# Altium project EL.T01.MBRD.PrjPcb (part 1 of 2)
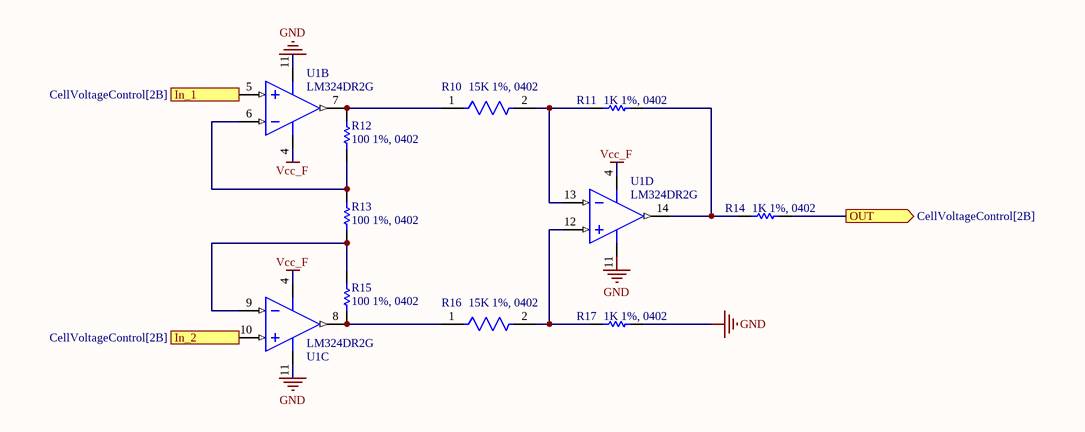
[diagram p0: DiffAmp_K-0.2.SchDoc]
7 sheets, 235 parts. Net scope: hierarchical (ports join the sheet entries above them; power ports are global).
Sheets:
  DiffAmp_K-0.2.SchDoc
  DiffAmp_K-10.SchDoc
  MainBoard.SchDoc
    CurrentSence = MainShunt.SchDoc
    Voltmetr = WideRangeVoltmeter.SchDoc
    CellVoltage = CellVoltageControl.SchDoc
      Voltmetr = WideRangeVoltmeter.SchDoc
      CellSelectModule = CellSelectModule.SchDoc
      CellSelectModule = CellSelectModule.SchDoc
      CellSelectModule = CellSelectModule.SchDoc
      CellSelectModule = CellSelectModule.SchDoc
      CellSelectModule = CellSelectModule.SchDoc
      CellSelectModule = CellSelectModule.SchDoc
      CellSelectModule = CellSelectModule.SchDoc
      CellSelectModule = CellSelectModule.SchDoc
      CellSelectModule = CellSelectModule.SchDoc
      CellSelectModule = CellSelectModule.SchDoc
      CellSelectModule = CellSelectModule.SchDoc
      CellSelectModule = CellSelectModule.SchDoc
      CellSelectModule = CellSelectModule.SchDoc
      CellSelectModule = CellSelectModule.SchDoc
      CellSelectModule = CellSelectModule.SchDoc
      CellSelectModule = CellSelectModule.SchDoc
      CellSelectModule = CellSelectModule.SchDoc
      CellSelectModule = CellSelectModule.SchDoc
      CellSelectModule = CellSelectModule.SchDoc
      CellSelectModule = CellSelectModule.SchDoc
      CellSelectModule = CellSelectModule.SchDoc
      CellSelectModule = CellSelectModule.SchDoc
      CellSelectModule = CellSelectModule.SchDoc
      CellSelectModule = CellSelectModule.SchDoc

## Sheet DiffAmp_K-0.2.SchDoc
size A3; SheetNumber: 5; SheetTotal: 8

### Parts
R10  15K 1%, 0402  [FP-ERJ2R-MFG]
R11  1K 1%, 0402  [RESC1005X40X25NL05T05]
R12  100 1%, 0402  [RESC1005X40X25LL05T05]
R13  100 1%, 0402  [RESC1005X40X25LL05T05]
R14  1K 1%, 0402  [RESC1005X40X25NL05T05]
R15  100 1%, 0402  [RESC1005X40X25LL05T05]
R16  15K 1%, 0402  [FP-ERJ2R-MFG]
R17  1K 1%, 0402  [RESC1005X40X25NL05T05]
U1  LM324DR2G  [ONSC-SOIC-14-751A-03_V]  (parts B,C,D of 4)

### Ports
In_1 (in, see CellVoltageControl[2B]), In_2 (in, see CellVoltageControl[2B]), OUT (out, see CellVoltageControl[2B])

### Nets
GND: R17.2 U1.11(VEE/GND)
Vcc_F: U1.4(VCC)
NetR10_1: R10.1 R12.2 U1.7(OUT2)
NetR10_2: R10.2 R11.1 U1.13(IN4-)
NetR11_2: R11.2 R14.1 U1.14(OUT4)
NetR12_1: R12.1 R13.2 U1.6(IN2-)
NetR13_1: R13.1 R15.2 U1.9(IN3-)
NetR14_2: R14.2 ; port OUT
NetR15_1: R15.1 R16.1 U1.8(OUT3)
NetR16_2: R16.2 R17.1 U1.12(IN4+)
NetU1_5: U1.5(IN2+) ; port In_1
NetU1_10: U1.10(IN3+) ; port In_2

### Notes on the sheet
- Labels drawn without touching a wire or pin: GND

### Library data of the parts
R10 R16 = CMP-2002-00694-4: RES SMD 15K OHM 1% 1/10W 0402; Manufacturer Part Number: ERJ-2RKF1502X; Manufacturer: Panasonic; Automotive Grade: Grade 0; Voltage Rating: 50V; Resistance: 15kΩ; Temperature Coefficient: 100ppm/°C; Power Rating: 0.1W; Value: 15kΩ; ComponentLink2URL: https://industrial.panasonic.com/cdbs/www-data/pdf/RDA0000/AOA0000C304.pdf; Automotive: Yes; Temperature: -55°C to +155°C; Height: 0.4mm; Digikey Description: RES SMD 15K OHM 1% 1/10W 0402; Category: Res; Device Class L2: Resistors; Device Class L1: Passive Components; Package: ERJ2R; Temperature Range Low: -55°C; Tolerance: 1%; Series: ERJ; Footprint Url: https://b2b-api.panasonic.eu/file_stream/pids/fileversion/1180; Mouser Description: Res Thick Film 1.0 x 0.5 mm 15K Ohm 1% 0.1W(1/10W) 100ppm/ C Molded SMD Punched Carrier T/R; Composition: Thick Film; Lead Free: Yes; Device Class L3: Chip SMD Resistors; Octopart: https://octopart.com/erj-2rkf1502x-panasonic-55404985; RoHS: TRUE; Temperature Range High: +155°C; ComponentLink2Description: Datasheet
R11 R14 R17 = CMP-1011-00510-4: Chip Resistor, 1 KOhm, +/- 1%, 100 mW, -55 to 155 degC, 0402 (1005 Metric), RoHS, Tape and Reel; PartNumber: ERJ-2RKF1001X; Manufacturer: Basic Passives; Voltage Rating: 50 V; Case\/Package: 0402; Resistance: 1 KOhm; Power Rating: 100 mW; DatasheetVersion: 04/2015; Radiation Hardening: No; Pins: 2; Height: 0.35 mm; RoHSCompliant: true; Case Code (Imperial): 0402; ComponentLink2Description: Datasheet; ComponentLink1Description: Manufacturer URL; PackageReference: 0402; Mount: Surface Mount; Package Quantity: 10000; Tolerance: 1%; ComponentLink1URL: http://www.panasonic.com/; PackageDescription: 2-Pin Surface Mount Device, Body 1 x 0.5 mm; Mounting Technology: Surface Mount; Case Code (Metric): 1005; ComponentLink2URL: http://industrial.panasonic.com/cdbs/www-data/pdf/RDA0000/AOA0000C86.pdf; REACH SVHC: Yes; Packaging: Tape and Reel; Max Operating Temperature: 155 degC; Min Operating Temperature: -55 degC; Width: 0.5 mm; Length: 1 mm
R12 R13 R15 = CMP-2002-00605-3: Chip Resistor, 100 Ohm, +/- 1%, 100 mW, -55 to 155 degC, 0402 (1005 Metric), RoHS, Tape and Reel; Manufacturer: Basic Passives; PartNumber: ERJ-2RKF1000X; Power Rating: 100 mW; Resistance: 100 Ohm; Voltage Rating: 50 V; Case\/Package: 0402; Width: 0.5 mm; Pins: 2; ComponentLink2Description: Datasheet; PackageReference: 0402; Height: 0.35 mm; Tolerance: 1%; DatasheetVersion: 04/2015; Case Code (Imperial): 0402; Min Operating Temperature: -55 degC; Radiation Hardening: No; Length: 1 mm; Package Quantity: 10000; PackageDescription: 2-Pin Surface Mount Device, Body 1 x 0.5 mm; Mounting Technology: Surface Mount; Case Code (Metric): 1005; Packaging: Tape and Reel; ComponentLink1URL: http://www.panasonic.com/; RoHSCompliant: true; Max Operating Temperature: 155 degC; REACH SVHC: Yes; ComponentLink1Description: Manufacturer URL; ComponentLink2URL: http://industrial.panasonic.com/cdbs/www-data/pdf/RDA0000/AOA0000C86.pdf; Mount: Surface Mount
U1 = CMP-1310-00171-1: Single Supply Quad Operational Amplifier, 3 to 32 V, 0 to 70 degC, 14-Pin SOIC, Pb-Free, Tape and Reel; Manufacturer: On Semiconductor; VCC Max (V): 32; VCC Min (V): 3; PackageVersion: Rev. K, 05/2011; ComponentLink3URL: http://www.onsemi.com/pub_link/Collateral/751A-03.PDF; ComponentLink3Description: Package Specification; Packing: Tape and Reel; ComponentLink2URL: http://www.onsemi.cn/pub_link/Collateral/LM324-D.PDF; PackageReference: SOIC-14-751A-03; ComponentLink1URL: http://www.onsemi.com/; PackageDescription: 14-Pin Small Outline Integrated Circuit, Body 8.65 x 3.9 mm, Pitch 1.27 mm; ComponentLink1Description: Manufacturer URL; DatasheetVersion: Rev. 25; Mounting Technology: Surface Mount; RoHS: TRUE; ComponentLink2Description: Datasheet; PartNumber: LM324DR2G

## Sheet DiffAmp_K-10.SchDoc
size A4; SheetNumber: 6; SheetTotal: 8
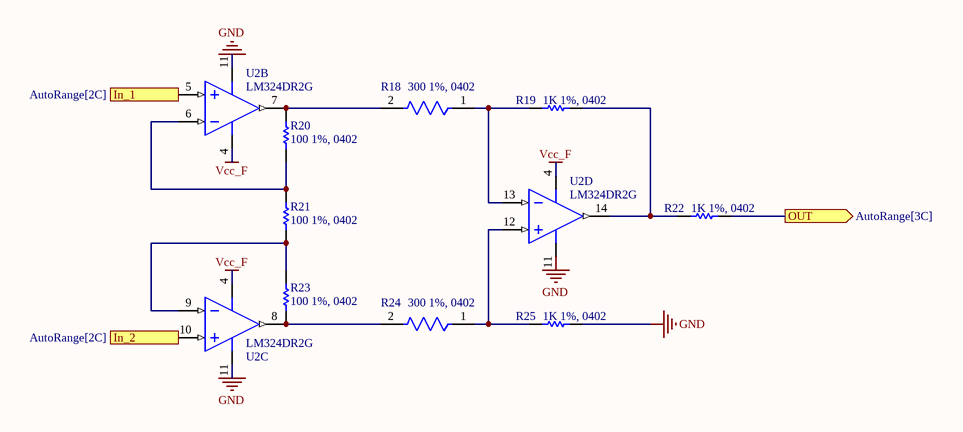
[diagram p1: DiffAmp_K-10.SchDoc]

### Parts
R18  300 1%, 0402  [FP-ERJ2RK-IPC_A]
R19  1K 1%, 0402  [RESC1005X40X25NL05T05]
R20  100 1%, 0402  [RESC1005X40X25LL05T05]
R21  100 1%, 0402  [RESC1005X40X25LL05T05]
R22  1K 1%, 0402  [RESC1005X40X25NL05T05]
R23  100 1%, 0402  [RESC1005X40X25LL05T05]
R24  300 1%, 0402  [FP-ERJ2RK-IPC_A]
R25  1K 1%, 0402  [RESC1005X40X25NL05T05]
U2  LM324DR2G  [ONSC-SOIC-14-751A-03_V]  (parts B,C,D of 4)

### Ports
In_1 (in, see AutoRange[2C]), In_2 (in, see AutoRange[2C]), OUT (out, see AutoRange[3C])

### Nets
GND: R25.2 U2.11(VEE/GND)
Vcc_F: U2.4(VCC)
NetR18_1: R18.1 R19.1 U2.13(IN4-)
NetR18_2: R18.2 R20.2 U2.7(OUT2)
NetR19_2: R19.2 R22.1 U2.14(OUT4)
NetR20_1: R20.1 R21.2 U2.6(IN2-)
NetR21_1: R21.1 R23.2 U2.9(IN3-)
NetR22_2: R22.2 ; port OUT
NetR23_1: R23.1 R24.2 U2.8(OUT3)
NetR24_1: R24.1 R25.1 U2.12(IN4+)
NetU2_5: U2.5(IN2+) ; port In_1
NetU2_10: U2.10(IN3+) ; port In_2

### Notes on the sheet
- Labels drawn without touching a wire or pin: GND

### Library data of the parts
R18 R24 = CMP-1011-00449-3: RES SMD 300 OHM 1% 1/10W 0402; Power Rating: 100mW; Voltage Rating: 50V; Temperature Coefficient: 100ppm/°C; Resistance: 300R; Case Code (Imperial): 0402; Termination: SMD/SMT; REACH SVHC: No SVHC; Number of Terminations: 2; Composition: Thick Film; Case Code (Metric): 1005; Voltage Rating (DC): 50V; Packaging: Tape and Reel; Max Power Dissipation: 100mW; Tolerance: 1%; Lead Free: Lead Free; Military Standard: Not; Mount: Surface Mount; Height: 0.35mm; Package Quantity: 10000; Max Operating Temperature: 155°C; Depth: 0.5mm; Min Operating Temperature: -55°C; Length: 1mm; Contact Plating: Tin; Width: 0.02inch; Case/Package: 0402
R19 R22 R25 = CMP-1011-00510-4: as R11 on sheet DiffAmp_K-0.2; DatasheetVersion: 04/2015; Radiation Hardening: No; Pins: 2; Height: 0.35 mm; RoHSCompliant: true; Case Code (Imperial): 0402; ComponentLink2Description: Datasheet; ComponentLink1Description: Manufacturer URL; PackageReference: 0402; Mount: Surface Mount; Package Quantity: 10000; Tolerance: 1%; ComponentLink1URL: http://www.panasonic.com/; PackageDescription: 2-Pin Surface Mount Device, Body 1 x 0.5 mm; Mounting Technology: Surface Mount; Case Code (Metric): 1005; ComponentLink2URL: http://industrial.panasonic.com/cdbs/www-data/pdf/RDA0000/AOA0000C86.pdf; REACH SVHC: Yes; Packaging: Tape and Reel; Max Operating Temperature: 155 degC; Min Operating Temperature: -55 degC; Width: 0.5 mm; Length: 1 mm
R20 R21 R23 = CMP-2002-00605-3: as R12 on sheet DiffAmp_K-0.2; Width: 0.5 mm; Pins: 2; ComponentLink2Description: Datasheet; PackageReference: 0402; Height: 0.35 mm; Tolerance: 1%; DatasheetVersion: 04/2015; Case Code (Imperial): 0402; Min Operating Temperature: -55 degC; Radiation Hardening: No; Length: 1 mm; Package Quantity: 10000; PackageDescription: 2-Pin Surface Mount Device, Body 1 x 0.5 mm; Mounting Technology: Surface Mount; Case Code (Metric): 1005; Packaging: Tape and Reel; ComponentLink1URL: http://www.panasonic.com/; RoHSCompliant: true; Max Operating Temperature: 155 degC; REACH SVHC: Yes; ComponentLink1Description: Manufacturer URL; ComponentLink2URL: http://industrial.panasonic.com/cdbs/www-data/pdf/RDA0000/AOA0000C86.pdf; Mount: Surface Mount
U2 = CMP-1310-00171-1: as U1 on sheet DiffAmp_K-0.2; PackageVersion: Rev. K, 05/2011; ComponentLink3URL: http://www.onsemi.com/pub_link/Collateral/751A-03.PDF; ComponentLink3Description: Package Specification; Packing: Tape and Reel; ComponentLink2URL: http://www.onsemi.cn/pub_link/Collateral/LM324-D.PDF; PackageReference: SOIC-14-751A-03; ComponentLink1URL: http://www.onsemi.com/; PackageDescription: 14-Pin Small Outline Integrated Circuit, Body 8.65 x 3.9 mm, Pitch 1.27 mm; ComponentLink1Description: Manufacturer URL; DatasheetVersion: Rev. 25; Mounting Technology: Surface Mount; RoHS: TRUE; ComponentLink2Description: Datasheet; PartNumber: LM324DR2G

## Sheet MainBoard.SchDoc
size A3; SheetNumber: 4; SheetTotal: 8
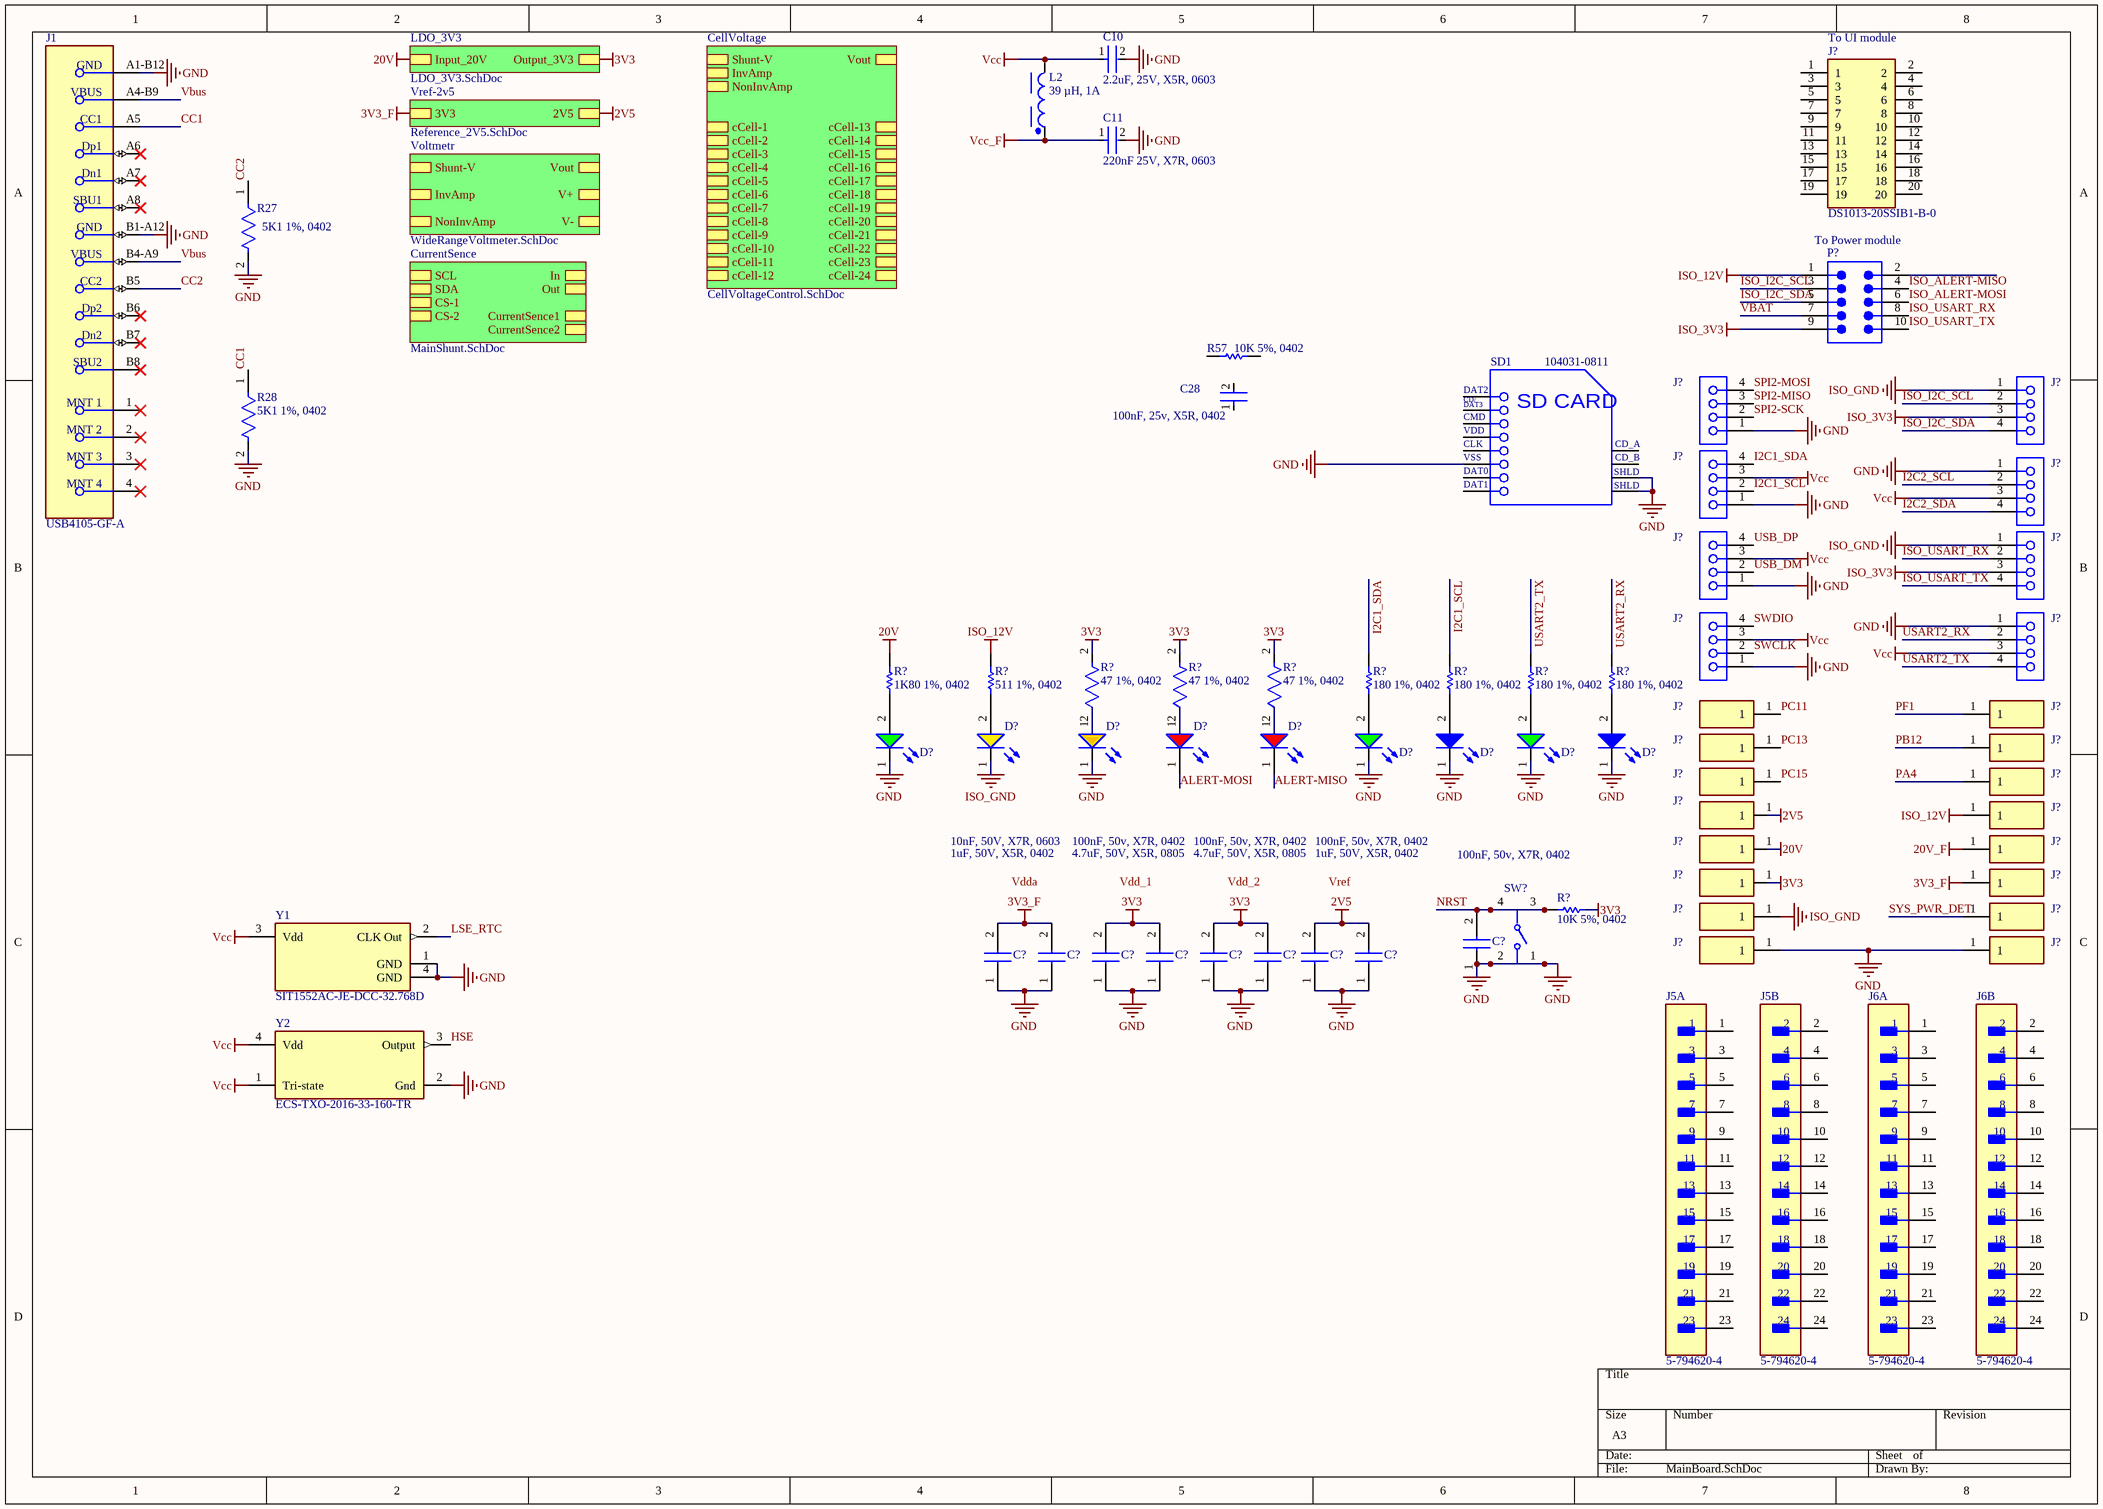
[diagram p2: MainBoard.SchDoc]

### Parts
(Parts that share a designator on the sheet are numbered #1, #2 ... from top to bottom, then left to right.)
C10  2.2uF, 25V, X5R, 0603  [FP-GRM188-0_1-e0_2_0_5-MFG]
C11  220nF 25V, X7R, 0603  [FP-GCM188-0_1-IPC_B]
C28  100nF, 25v, X5R, 0402  [FP-GRM155-0_05-IPC_C]
C?#1  100nF, 50v, X7R, 0402  [CAPC2012X88N]  (value not drawn)
C?#2  10nF, 50V, X7R, 0603  [CAPC1608X87N]  (value not drawn)
C?#3  1uF, 50V, X5R, 0402  [GRM15x]  (value not drawn)
C?#4  100nF, 50v, X7R, 0402  [CAPC2012X88N]  (value not drawn)
C?#5  4.7uF, 50V, X5R, 0805  [CAPC2012X145N]  (value not drawn)
C?#6  100nF, 50v, X7R, 0402  [CAPC2012X88N]  (value not drawn)
C?#7  4.7uF, 50V, X5R, 0805  [CAPC2012X145N]  (value not drawn)
C?#8  100nF, 50v, X7R, 0402  [CAPC2012X88N]  (value not drawn)
C?#9  1uF, 50V, X5R, 0402  [GRM15x]  (value not drawn)
D?#1  150060GS75000  [WL-SMCW_0603_150060xx75000]  (value not drawn)
D?#2  150060YS75000  [WL-SMCW_0603_150060xx75000]  (value not drawn)
D?#3  150060AS75000  [WL-SMCW_0603_150060xx75000]  (value not drawn)
D?#4  150060RS75000  [WL-SMCW_0603_150060xx75000]  (value not drawn)
D?#5  150060RS75000  [WL-SMCW_0603_150060xx75000]  (value not drawn)
D?#6  150060GS75000  [WL-SMCW_0603_150060xx75000]  (value not drawn)
D?#7  150060BS75000  [WL-SMCW_0603_150060xx75000]  (value not drawn)
D?#8  150060GS75000  [WL-SMCW_0603_150060xx75000]  (value not drawn)
D?#9  150060BS75000  [WL-SMCW_0603_150060xx75000]  (value not drawn)
J1  USB4105-GF-A  [FP-USB4105-GF-A-MFG]
J5  5-794620-4  [FP-5-794620-4-MFG]  (parts A,B of 2)
J6  5-794620-4  [FP-5-794620-4-MFG]  (parts A,B of 2)
J?#1  DS1013-20SSIB1-B-0  [SHDR20W69P254X254_2X10_3300X910X955P]
J?#2  61300411821  [61300411821]  (value not drawn)  (net tie, no BOM)
J?#3  61300411821  [61300411821]  (value not drawn)  (net tie, no BOM)
J?#4  61300411821  [61300411821]  (value not drawn)  (net tie, no BOM)
J?#5  61300411821  [61300411821]  (value not drawn)  (net tie, no BOM)
J?#6  61300411821  [61300411821]  (value not drawn)  (net tie, no BOM)
J?#7  61300411821  [61300411821]  (value not drawn)  (net tie, no BOM)
J?#8  61300411821  [61300411821]  (value not drawn)  (net tie, no BOM)
J?#9  61300411821  [61300411821]  (value not drawn)  (net tie, no BOM)
J?#10  TestPad  [TestPad]  (value not drawn)  (no BOM)
J?#11  TestPad  [TestPad]  (value not drawn)  (no BOM)
J?#12  TestPad  [TestPad]  (value not drawn)  (no BOM)
J?#13  TestPad  [TestPad]  (value not drawn)  (no BOM)
J?#14  TestPad  [TestPad]  (value not drawn)  (no BOM)
J?#15  TestPad  [TestPad]  (value not drawn)  (no BOM)
J?#16  TestPad  [TestPad]  (value not drawn)  (no BOM)
J?#17  TestPad  [TestPad]  (value not drawn)  (no BOM)
J?#18  TestPad  [TestPad]  (value not drawn)  (no BOM)
J?#19  TestPad  [TestPad]  (value not drawn)  (no BOM)
J?#20  TestPad  [TestPad]  (value not drawn)  (no BOM)
J?#21  TestPad  [TestPad]  (value not drawn)  (no BOM)
J?#22  TestPad  [TestPad]  (value not drawn)  (no BOM)
J?#23  TestPad  [TestPad]  (value not drawn)  (no BOM)
J?#24  TestPad  [TestPad]  (value not drawn)  (no BOM)
J?#25  TestPad  [TestPad]  (value not drawn)  (no BOM)
L2  39 µH, 1A  [WE-PD_7345]
P?  61201021621  [61201021621]  (value not drawn)
R27  5K1 1%, 0402  [FP-ERJ2RK-IPC_A]
R28  5K1 1%, 0402  [FP-ERJ2RK-IPC_A]
R57  10K 5%, 0402  [RESC1005X40X25ML05T05]
R?#1  180 1%, 0402  [RESC1005X40X25NL05T05]
R?#2  180 1%, 0402  [RESC1005X40X25NL05T05]
R?#3  180 1%, 0402  [RESC1005X40X25NL05T05]
R?#4  180 1%, 0402  [RESC1005X40X25NL05T05]
R?#5  1K80 1%, 0402  [RESC1005X40X25NL10T10]
R?#6  511 1%, 0402  [RESC1005X40X25ML05T05]
R?#7  47 1%, 0402  [FP-ERJ2RK-IPC_C]
R?#8  47 1%, 0402  [FP-ERJ2RK-IPC_C]
R?#9  47 1%, 0402  [FP-ERJ2RK-IPC_C]
R?#10  10K 5%, 0402  [RESC1005X40X25ML05T05]
SD1  104031-0811  [MOLX-104031-0811_V]
SW?  PTS810SJM250SMTRLFS  [FP-PTS810SJM250SMTRLFS-MFG]  (value not drawn)
Y1  SIT1552AC-JE-DCC-32.768D  [FP-SiT1552-J-MFG]
Y2  ECS-TXO-2016-33-160-TR  [FP-TXO-2016-MFG]

### Sub-sheets
CellVoltage = CellVoltageControl.SchDoc: InvAmp, NonInvAmp, Shunt-V, Vout, cCell-1, cCell-2, cCell-3, cCell-4, cCell-5, cCell-6, cCell-7, cCell-8, cCell-9, cCell-10, cCell-11, cCell-12, cCell-13, cCell-14, cCell-15, cCell-16, cCell-17, cCell-18, cCell-19, cCell-20, cCell-21, cCell-22, cCell-23, cCell-24
CurrentSence = MainShunt.SchDoc: CurrentSence1, CurrentSence2, CS-1, CS-2, SDA, SCL, In, Out
LDO_3V3 = LDO_3V3.SchDoc (file not in this document): Output_3V3, Input_20V
Voltmetr = WideRangeVoltmeter.SchDoc: InvAmp, NonInvAmp, V-, V+, Shunt-V, Vout
Vref-2v5 = Reference_2V5.SchDoc (file not in this document): 2V5, 3V3

### Nets
2V5: C?#8.2 C?#9.2 J?#16.1 ; sheet Vref-2v5/2V5
3V3: C?#4.2 C?#5.2 C?#6.2 C?#7.2 J?#20.1 R?#7.2 R?#8.2 R?#9.2 R?#10.1 ; sheet LDO_3V3/Output_3V3
3V3_F: C?#2.2 C?#3.2 J?#21.1 ; sheet Vref-2v5/3V3
20V: J?#18.1 R?#5.2 ; sheet LDO_3V3/Input_20V
20V_F: J?#19.1
GND: C10.2 C11.2 C?#1.1 C?#2.1 C?#3.1 C?#4.1 C?#5.1 C?#6.1 C?#7.1 C?#8.1 C?#9.1 D?#1.1(K) D?#3.1(K) D?#6.1(K) D?#7.1(K) D?#8.1(K) D?#9.1(K) J1.A1-B12(GND) J1.B1-A12(GND) J?#3.1 J?#4.1 J?#5.1 J?#7.1 J?#8.1 J?#9.1 J?#24.1 J?#25.1 R27.2 R28.2 SD1.6(VSS2) SD1.11(SHLD1) SD1.12(SHLD2) SW?.1 SW?.2 Y1.1(GND) Y1.4(GND) Y2.2(Gnd)
ISO_3V3: J?#2.3 J?#6.3 P?.9
ISO_12V: J?#17.1 P?.1 R?#6.2
ISO_GND: D?#2.1(K) J?#2.1 J?#6.1 J?#22.1
Vcc: C10.1 J?#4.3 J?#5.3 J?#7.3 J?#8.3 J?#9.3 L2.2 Y1.3(Vdd) Y2.1(Tri-state) Y2.4(Vdd)
Vcc_F: C11.1 L2.1
ALERT-MISO: D?#5.1(K)
ALERT-MOSI: D?#4.1(K)
CC1: J1.A5(CC1) R28.1
CC2: J1.B5(CC2) R27.1
HSE: Y2.3(Output)
I2C1_SCL: J?#5.2 R?#2.1
I2C1_SDA: J?#5.4 R?#1.1
I2C2_SCL: J?#4.2
I2C2_SDA: J?#4.4
ISO_ALERT-MISO: P?.4
ISO_ALERT-MOSI: P?.6
ISO_I2C_SCL: J?#2.2 P?.3
ISO_I2C_SDA: J?#2.4 P?.5
ISO_USART_RX: J?#6.2 P?.8
ISO_USART_TX: J?#6.4 P?.10
LSE_RTC: Y1.2(CLK_Out)
NRST: C?#1.2 R?#10.2 SW?.3 SW?.4
PA4: J?#15.1
PB12: J?#13.1
PC11: J?#10.1
PC13: J?#12.1
PC15: J?#14.1
PF1: J?#11.1
SPI2-MISO: J?#3.3
SPI2-MOSI: J?#3.4
SPI2-SCK: J?#3.2
SWCLK: J?#9.2
SWDIO: J?#9.4
SYS_PWR_DET: J?#23.1
USART2_RX: J?#8.2 R?#4.1
USART2_TX: J?#8.4 R?#3.1
USB_DM: J?#7.2
USB_DP: J?#7.4
VBAT: P?.7
Vbus: J1.A4-B9(VBUS) J1.B4-A9(VBUS)
NetD?#1_2: D?#1.2(A) R?#5.1
NetD?#2_2: D?#2.2(A) R?#6.1
NetD?#3_2: D?#3.2(A) R?#7.1
NetD?#4_2: D?#4.2(A) R?#8.1
NetD?#5_2: D?#5.2(A) R?#9.1
NetD?#6_2: D?#6.2(A) R?#1.2
NetD?#7_2: D?#7.2(A) R?#2.2
NetD?#8_2: D?#8.2(A) R?#3.2
NetD?#9_2: D?#9.2(A) R?#4.2

Not connected (* = marked no-connect by the designer): C28 1 2; J1 1(MNT_1)* 2(MNT_2)* 3(MNT_3)* 4(MNT_4)* A6(Dp1)* A7(Dn1)* A8(SBU1)* B6(Dp2)* B7(Dn2)* B8(SBU2)*; J5 1 2 3 4 5 6 7 8 9 10 11 12 13 14 15 16 17 18 19 20 21 22 23 24; J6 1 2 3 4 5 6 7 8 9 10 11 12 13 14 15 16 17 18 19 20 21 22 23 24; J?#1 1 2 3 4 5 6 7 8 9 10 11 12 13 14 15 16 17 18 19 20; P? 2; R57 1 2; SD1 1(CD/DAT3) 2(CMD) 3(VSS1) 4(VDD) 5(CLK) 7(DAT0) 8(DAT1) 9(CD_A) 10(CD_B)

### Notes on the sheet
- (near J?#1) To UI module
- To Power module
- 1uF, 50V, X5R, 0402
- 10nF, 50V, X7R, 0603
- 4.7uF, 50V, X5R, 0805
- 100nF, 50v, X7R, 0402
- Vdda
- Vdd_1
- Vdd_2
- Vref
- (in symbol CMP-2000-05825-1) DAT2; CD/; DAT3; SD CARD; VSS; SHLD

### Library data of the parts
C10 = CMP-2006-02820-2: Chip Multilayer Ceramic Capacitors for General Purpose, 0603, 2.2uF, X5R, 15%, 10%, 25V; Number of Pins: 2; Dielectric: X5R; Tolerance: 10%; Case Code (Imperial): 0603; Thickness: 0.035inch; Case/Package: 0603; Lead Free: Lead Free; Mount: Surface Mount; Material: Ceramic; Depth: 0.8mm; Voltage: 25V; Capacitance: 2.2uF; Min Operating Temperature: -55°C; Package Quantity: 4000; REACH SVHC: No SVHC; Resistor Type: Ceramic; Packaging: Tape and Reel; Case Code (Metric): 1608; Max Operating Temperature: 85°C; Width: 0.8mm; Termination: SMD/SMT; Voltage Rating: 25V; Length: 1.6mm; Voltage Rating (DC): 25V; Height: 0.8mm; Radiation Hardening: No; Weight: 0.000222oz
C11 = CMP-2006-02366-2: Ceramic Capacitor for Automotive 220nF  ±10% 25VDC X7R 0603 Paper T/R; Capacitance: 220nF; Mount: Surface Mount; Ratings: AEC-Q200; Case/Package: 0603; Packaging: Tape and Reel; Radiation Hardening: No; Voltage: 25V; Dielectric: X7R; Case Code (Imperial): 0603; Max Operating Temperature: 125°C; Min Operating Temperature: -55°C; Depth: 0.8mm; Termination: SMD/SMT; Package Quantity: 1; Case Code (Metric): 1608; Thickness: 0.035inch; Voltage Rating: 25V; Tolerance: 10%; Voltage Rating (DC): 25V; Height: 0.8mm; Lead Free: Lead Free; Length: 1.6mm; Width: 0.031inch
C28 = CMP-06035-003661-1: Chip Multilayer Ceramic Capacitors for General Purpose, 0402, 0.10uF, X7R, 15%, 10%, 25V; Length: 1mm; Depth: 0.5mm; Dielectric: X7R; Voltage Rating: 25V; Lead Free: Lead Free; Case Code (Imperial): 0402; Voltage: 25V; Min Operating Temperature: -55°C; Tolerance: 10%; Dielectric Material: Ceramic; Voltage Rating (DC): 25V; Max Operating Temperature: 125°C; Capacitance: 100nF; Thickness: 0.022inch; Case/Package: 0402; Height: 0.5mm; Resistor Type: Ceramic; Weight: 0.000212oz; Case Code (Metric): 1005; Package Quantity: 10000; Termination: SMD/SMT; Width: 0.02inch; Mount: Surface Mount; Packaging: Tape and Reel
C?#1 C?#4 C?#6 C?#8 = C0805C104M5RAC: Capacitor; Manufacturer_Name: KEMET; Datasheet Link: https://connect.kemet.com:7667/gateway/IntelliData-ComponentDocumentation/1.0/download/specsheet/C0805C104M5RAC%7bBULK%7d; Height: 0.88mm; Manufacturer_Part_Number: C0805C104M5RAC; Mouser Part Number: 80-C0805C104M5RAC; Mouser Price/Stock: https://www.mouser.co.uk/ProductDetail/KEMET/C0805C104M5RAC?qs=VOOUd%252Bza08rWzt4y8eXMuQ%3D%3D; Arrow Part Number: C0805C104M5RAC; Arrow Price/Stock: https://www.arrow.com/en/products/c0805c104m5rac/kemet-corporation?utm_currency=USD&region=nac
C?#2 = C0603C103J5RAC: Capacitor; Manufacturer_Name: KEMET; Datasheet Link: https://www.kemet.com/specsheet/C0603C103J5RAC%7BBULK%7D; Height: 0.87mm; Manufacturer_Part_Number: C0603C103J5RAC; Mouser Part Number: 80-C0603C103J5RAC; Mouser Price/Stock: https://www.mouser.co.uk/ProductDetail/KEMET/C0603C103J5RAC?qs=Zjfhvh7dXTOjKlZBdCXdvg%3D%3D; Arrow Part Number: C0603C103J5RAC; Arrow Price/Stock: https://www.arrow.com/en/products/c0603c103j5rac/kemet-corporation?region=nac
C?#3 C?#9 = GRM155R61H105KE05J: Capacitor; Manufacturer_Name: Murata Electronics; Datasheet Link: https://search.murata.co.jp/Ceramy/image/img/A01X/G101/ENG/GRM155R61H105KE05-01A.pdf; Height: 0.33mm; Manufacturer_Part_Number: GRM155R61H105KE05J; Mouser Part Number: 81-GRM155R61H105KE5J; Mouser Price/Stock: https://www.mouser.co.uk/ProductDetail/Murata-Electronics/GRM155R61H105KE05J?qs=d0WKAl%252BL4KZilUxqJ3m7lA%3D%3D; Arrow Part Number: GRM155R61H105KE05J; Arrow Price/Stock: https://www.arrow.com/en/products/grm155r61h105ke05j/murata-manufacturing?region=nac
C?#5 C?#7 = GRM21BR61H475ME51L: Capacitor; Manufacturer_Name: Murata Electronics; Datasheet Link: https://search.murata.co.jp/Ceramy/image/img/A01X/G101/ENG/GRM21BR61H475ME51-01A.pdf; Height: 1.45mm; Manufacturer_Part_Number: GRM21BR61H475ME51L; Mouser Part Number: 81-GRM21BR61H475M51L; Mouser Price/Stock: https://www.mouser.co.uk/ProductDetail/Murata-Electronics/GRM21BR61H475ME51L?qs=eeBpzGFlv%252B%2Fg0wAeHy0eJw%3D%3D; Arrow Part Number: GRM21BR61H475ME51L; Arrow Price/Stock: https://www.arrow.com/en/products/grm21br61h475me51l/murata-manufacturing?region=nac
D?#1 D?#6 D?#8 = CMP-1426-00002-4: 430mcd Colorless transparence 520nm Emerald 140° LED0603 Light Emitting Diodes (LED) ROHS; Peak Wavelength: 515nm; Forward Current: 100mA; Reverse Voltage: 5V; Output Current: 10µA; Power Dissipation: 105mW; Lens Style: Clear, Rectangular; Dominant Wavelength: 525nm; Color: Green; Test Current: 20mA; Max Junction Temperature (Tj): 95°C; Forward Voltage: 3.2V; Width: 800µm; Max Operating Temperature: 85°C; Case Code (Metric): 1608; Luminous Intensity: 430mcd; Lead Free: Lead Free; Case/Package: 0603; Case Code (Imperial): 0603; Mount: Surface Mount; Max Reverse Voltage (DC): 5V; Packaging: Tape and Reel; RoHS: Compliant; Viewing Angle: 140°; REACH SVHC: Unknown; Min Operating Temperature: -40°C; Height: 700µm; Wavelength: 525nm; Length: 1.6mm
D?#2 = CMP-1426-00005-3: WL-SMCW SMT Mono-Color Chip LED Waterclear; Power Dissipation: 72mW; Reverse Voltage: 5V; Forward Voltage: 2V; Test Current: 20mA; Luminous Intensity: 120mcd; Max Junction Temperature (Tj): 95°C; Wavelength: 590nm; Color: Yellow; Forward Current: 100mA; Lens Style: Clear, Rectangular; Viewing Angle: 140°; Peak Wavelength: 595nm; Case Code (Metric): 1608; Length: 1.6mm; Max Reverse Voltage (DC): 5V; Case Code (Imperial): 0603; Dominant Wavelength: 590nm; Mount: Surface Mount; Max Operating Temperature: 85°C; Min Operating Temperature: -40°C; Packaging: Tape and Reel; REACH SVHC: Unknown; Width: 800µm; Case/Package: 0603; Height: 700µm; RoHS: Compliant
D?#3 = CMP-03913-89970694-2: WL-SMCW SMT Mono-Color Chip LED Waterclear; Luminous Intensity: 130mcd; Max Reverse Voltage (DC): 5V; Viewing Angle: 140°; Dominant Wavelength: 605nm; Forward Current: 100mA; Forward Voltage: 2V; Peak Wavelength: 610nm; RoHS: Compliant; Min Operating Temperature: -40°C; Wavelength: 605nm; Max Operating Temperature: 85°C; Packaging: Tape and Reel
D?#4 D?#5 = CMP-1426-00001-4: LED Low-Power Uni-Color Red 630nm 2V 2-Pin Chip 0603(1608Metric) T/R; Max Junction Temperature (Tj): 95°C; Dominant Wavelength: 625nm; Lens Style: Clear, Rectangular; Viewing Angle: 140°; Forward Current: 100mA; Max Reverse Voltage (DC): 5V; Luminous Intensity: 250mcd; Test Current: 20mA; Power Dissipation: 72mW; Max Operating Temperature: 85°C; Mount: Surface Mount; Height: 700µm; Packaging: Tape and Reel; REACH SVHC: Unknown; Case Code (Metric): 1608; Peak Wavelength: 630nm; Forward Voltage: 2V; Case/Package: 0603; Color: Red; RoHS: Compliant; Width: 800µm; Reverse Voltage: 5V; Min Operating Temperature: -40°C; Wavelength: 625nm; Case Code (Imperial): 0603; Length: 1.6mm
D?#7 D?#9 = CMP-1426-00003-4: Led, Blue, 470 Nm, 3.2 V, 30 Ma, 145 Mcd Rohs Compliant: Yes; Peak Wavelength: 465nm; Dominant Wavelength: 470nm; Power Dissipation: 105mW; Viewing Angle: 140°; Test Current: 20mA; Max Junction Temperature (Tj): 95°C; Forward Current: 100mA; Reverse Voltage: 5V; Luminous Intensity: 145mcd; Lens Style: Clear, Rectangular; Forward Voltage: 3.2V; RoHS: Compliant; Min Operating Temperature: -40°C; REACH SVHC: Unknown; Max Operating Temperature: 85°C; Width: 800µm; Case Code (Imperial): 0603; Case Code (Metric): 1608; Max Reverse Voltage (DC): 5V; Height: 700µm; Case/Package: 0603; Mount: Surface Mount; Packaging: Tape and Reel; Color: Blue; Wavelength: 470nm; Length: 1.6mm
J1 = CMP-245163-000001-1: CONN RCPT USB2.0 TYPEC 5A; Manufacturer: GCT; Voltage Rating: 20V; Is Female: yes; Current Rating: 5/6.25/1.25/0.25A; Number Of Contacts: 16; Conn Orientation: Right Angle; Device Class L1: Connectors; Category: Conn; Lead Free: Yes; RoHS: TRUE; Temperature Range High: +85°C; Digikey Description: CONN RCPT USB2.0 TYPEC 5A; Device Class L3: unset; ComponentLink2Description: Datasheet; Manufacturer Part Number: USB4105-GF-A; Package: 0; Usb Standard: USB 2.0; Device Class L2: USB Connectors; Automotive: No; Temperature Range Low: -40°C; Height: 3.46mm; Temperature: -40°C to +85°C; Contact Material: Gold,Nickel; ComponentLink2URL: https://gct.co/files/drawings/usb4105.pdf; Octopart: https://octopart.com/usb4105-gf-a-gct-106627878
J5 J6 = CMP-03790-39517589-1: 5-794620-4 Conn Power HDR 24 POS 3mm Solder RA Thru-Hole 24 Terminal 1 Port Frame; Manufacturer Lifecycle Status: ACTIVE; Number of Contacts: 24; PCB Mounting Orientation: Right Angle; Contact Style: Pin; VDE Tested: Yes; Current Rating: 5A; Voltage Rating: 250V; Sealable: No; Plating Thickness: 8.89µm; Approvals: CSA; Number of Ports: 1; PCB Thickness: 1.6002mm; Row Spacing: 118µm; Contact Retention: Without; Connector System: Wire-to-Board; Plating: Gold; Pitch: 2.9972mm; Gender: Male; Lifecycle Status: Production; Flammability Rating: UL94 V-0; RoHS: Compliant; Packaging: Bulk; Fastening Type: Ramp; ELV: Compliant; Radiation Hardening: No; Lead Free: Lead Free; Housing Material: Nylon; Number of Rows: 2; Connector Type: Pin; Contact Current Rating: 5A; Operating Supply Voltage: 250V; Number of Power Positions: 24; Max Operating Temperature: 105°C; Circuit Application: Power; Housing Color: Black; Max Voltage Rating (AC): 250V; Number of Terminals: 24; Termination: Solder; Min Operating Temperature: -40°C; Lead Pitch: 3mm; Height: 8.93mm; Length: 40mm; Orientation: Right Angle; Mount: Through Hole; Contact Plating: Gold, Tin; NexarPartId: 39517589; Depth: 11.92mm; Color: Black; Number of Positions: 24; Contact Material: Brass
J?#1 = DS1013-20SSIB1-B-0: Connector; Manufacturer_Name: Connfly; Datasheet Link: https://www.tme.eu/Document/e9117e1c80532ff2c20cc520b4694ed9/DS1013.pdf; Height: 9.55mm; Manufacturer_Part_Number: DS1013-20SSIB1-B-0
J?#2-J?#9 = CMP-1502-01316-3: NexarPartId: 61924712; Contact Resistance: 20mΩ; Gender: Female; Current Rating: 3A; Operating Supply Voltage: 250V; RoHS: Non-Compliant; Number of Pins: 4; Orientation: Vertical; Lead Pitch: 2.54mm
J?#10-J?#25 = 61300111121: Connector; Manufacturer_Name: Wurth Elektronik; Datasheet Link: https://katalog.we-online.de/em/datasheet/6130xx11121.pdf; Height: 8.89mm; Manufacturer_Part_Number: 61300111121; Mouser Part Number: 710-61300111121; Mouser Price/Stock: https://www.mouser.co.uk/ProductDetail/Wurth-Elektronik/61300111121?qs=PhR8RmCirEaRH5Ck%252B2lRLQ%3D%3D
L2 = CMP-0227-00153-2: NexarPartId: 29930417; Max DC Current: 1.11A; Shielding: Shielded; Inductance: 39µH; Self Resonant Frequency: 11MHz; DC Resistance (DCR): 145mΩ; Tolerance: 20%; Ambient Temperature Range Low: -40°C; Width: 7.3mm; Length: 7.3mm; Number of Pins: 2; Packaging: Tape & Reel; Height: 4.5mm; Ambient Temperature Range High: 85°C; Max Operating Temperature: 125°C; Depth: 7.3mm; Min Operating Temperature: -40°C; RoHS: Compliant; Current Rating: 1.11A
P? = CMP-1502-00007-2: NexarPartId: 8917783; Number of Contacts: 10; Voltage Rating (DC): 250V; Insulation Resistance: 1GΩ; Current Rating: 3A; Row Spacing: 2.54mm; Contact Resistance: 20mΩ; Connector Type: Male Pin; Gender: Male; Flammability Rating: UL94 V-0; Termination: Solder; Width: 20.36mm; Length: 20.36mm; Housing Material: PBT; Operating Supply Voltage: 250V; Min Operating Temperature: -40°C; Lead Free: Lead Free; Insulation Material: PBT; Orientation: Vertical; RoHS: Compliant; Voltage Rating: 250V; Number of Pins: 10; Height: 8.85mm; REACH SVHC: Unknown; Contact Material: Copper; Contact Gender: Male; Color: Black; Mount: Through Hole; Contact Plating: Gold; Lead Pitch: 2.54mm; Number of Positions: 10; Pitch: 2.54mm; Max Operating Temperature: 105°C; Number of Rows: 2
R27 R28 = CMP-2002-01158-2: RES SMD 5.1K OHM 1% 1/10W 0402; Voltage Rating: 50V; Temperature Coefficient: 100ppm/°C; Resistance: 5.1kR; Power Rating: 100mW; Min Operating Temperature: -55°C; Technology: THICK FILM; Military Standard: Not; Depth: 0.5mm; Contact Plating: Tin; Tolerance: 1%; Construction: Rectangular; Length: 1mm; Case/Package: 0402; Lead Free: Lead Free; RoHS Compliant: Yes; Termination: SMD/SMT; Height: 0.35mm; Max Operating Temperature: 155°C; Case Code (Imperial): 0402; Number of Terminations: 2; Packaging: Tape and Reel; Case Code (Metric): 1005; Width: 0.5mm; Max Power Dissipation: 100mW; Package Quantity: 10000; Resistance Tolerance: 1%; REACH SVHC: No SVHC; Mount: Surface Mount; Series: ERJ; Voltage Rating (DC): 50V; Weight: 2.8E-05oz; Resistor Type: Thick Film
R57 R?#10 = CMP-2002-00433-1: Part Number: ERJ-2GEJ103X; Manufacturer: Panasonic
R?#1-R?#4 = CMP-2002-01127-1: Manufacturer: Panasonic; Part Number: ERJ2RKF1800X
R?#5 = CMP-2002-05845-1: Part Number: ERA-2AED182X; Manufacturer: Panasonic
R?#6 = CMP-2002-00976-1: Part Number: ERJ-2RKF5113X; Manufacturer: Panasonic
R?#7-R?#9 = CMP-1011-00360-3: RES SMD 47 OHM 1% 1/10W 0402; Resistance: 47R; Power Rating: 100mW; Temperature Coefficient: 100ppm/°C; Voltage Rating (DC): 50V; Case Code (Imperial): 0402; Width: 0.02inch; Height: 0.35mm; Features: Automotive AEC-Q200; Case/Package: 0402; RoHS Compliant: Yes; Lead Free: Lead Free; Case Code (Metric): 1005; Technology: THICK FILM; Termination: SMD/SMT; Tolerance: 1%; Resistance Tolerance: 1%; Max Operating Temperature: 155°C; Construction: Rectangular; Mount: Surface Mount; Min Operating Temperature: -55°C; Max Power Dissipation: 100mW; Number of Terminations: 2; Military Standard: Not; REACH SVHC: No SVHC; Resistor Type: Thick Film; Contact Plating: Tin; Package Quantity: 1; Series: ERJ; Packaging: Tape and Reel; Voltage Rating: 50V; Weight: 2.8E-05oz; Length: 1mm; Number of Pins: 2; Depth: 0.5mm
SD1 = CMP-2000-05825-1: Micro SD Card, RA, -25 to 85 degC, 8-Pin SMD, RoHS, Tape and Reel; Voltage Rating: 10VAC/DC; Number of Contacts: 8; Insertion - Extraction Style: Push-Pull; Pitch: 1.1mm; Mating Cycles: 10000; Brand: Molex; Current Rating: 500mA; Manufacturer URL: http://www.molex.com/; Card Type: microSD; Mounting Type: Standard; Height: 1.42mm; Mounting Technology: SurfaceMount; Contact Plating: Gold; Product Category: MemoryCardConnectors; Package Description: 8-Pin Surface Mount Device, Body 11.95 x 11.4 mm, Pitch 1.1 mm; Datasheet URL: http://www.molex.com/pdm_docs/sd/1040310811_sd.pdf; Termination Style: SMD; Length: 11.4mm; Housing Material: LiquidCrystalPolymer(LCP); Orientation: RightAngle; RoHS: True; Contact Material: PhosphorBronze; Datasheet Version: Rev. E, 04/2006; Packaging: Reel; Manufacturer: Molex; Series: 104031; Product: CardConnectors; Number of Rows: 1Row; Package Reference: 104031-0811
SW? = CMP-10040-000001-2: SWITCH TACTILE SPST-NO 0.05A 16V; Throw Configuration: SPST; Operating Force: 160gf; Actuator Type: Standard; Switch Travel: 0.15mm; Switch Function: Off-Mom; Max Current Rating: 50mA; Mechanical Life: 150000Cycles; Illumination Type: Non-Illuminated; Package Quantity: 2900; Depth: 4.6mm; Mount: Surface Mount; Packaging: Tape and Reel; Length: 3.2mm; RoHS Compliant: Yes; Case/Package: SMD/SMT; Voltage Rating (DC): 16V; Min Operating Temperature: -40°C; Termination: J-Bend; Lead Free: Lead Free; Contact Plating: Silver; Orientation: Straight; Max Operating Temperature: 85°C; Current Rating: 50mA; Color: Black
Y1 = CMP-25159-260295-1: MEMS OSC TCXO 32.7680KHZ LVCMOS; Frequency Stability: 5ppm; Frequency: 32.768kHz; Min Operating Temperature: 0°C; Length: 0.061inch; Mount: Surface Mount; Max Operating Temperature: 70°C; Width: 0.033inch; RoHS Compliant: Yes; Series: SiT1552; Packaging: Cut Tape; Height: 0.024inch
Y2 = CMP-40224-000008-1: XTAL OSC TCXO 16MHZ 3.3V SMD; Manufacturer: ECS; Max Supply Voltage: 3.63V; Max Supply Current: 7mA; Stability: 2ppm; Min Supply Voltage: 2.97V; Load Capacitance: 15pF; Frequency: 16MHz; Device Class L1: Passive Components; Manufacturer Part Number: ECS-TXO-2016-33-160-TR; Digikey Description: XTAL OSC TCXO 16MHZ 3.3V SMD; Device Class L3: Oscillators; Category: Crys; Lead Free: Yes; Temperature: -40°C to +85°C; RoHS: TRUE; ComponentLink2Description: Datasheet; Octopart: https://octopart.com/ecs-txo-2016-33-160-tr-ecs+international-102811109; ComponentLink2URL: https://ecsxtal.com/store/pdf/ECS-TXO-2016.pdf; Temperature Range High: +85°C; Height: 0.8mm; Device Class L2: Crystals / Oscillators; Package: TXO-2016; Temperature Range Low: -40°C; Series: TXO-2016; Automotive: No

## Sheet MainShunt.SchDoc
size A4; SheetNumber: 7; SheetTotal: 8
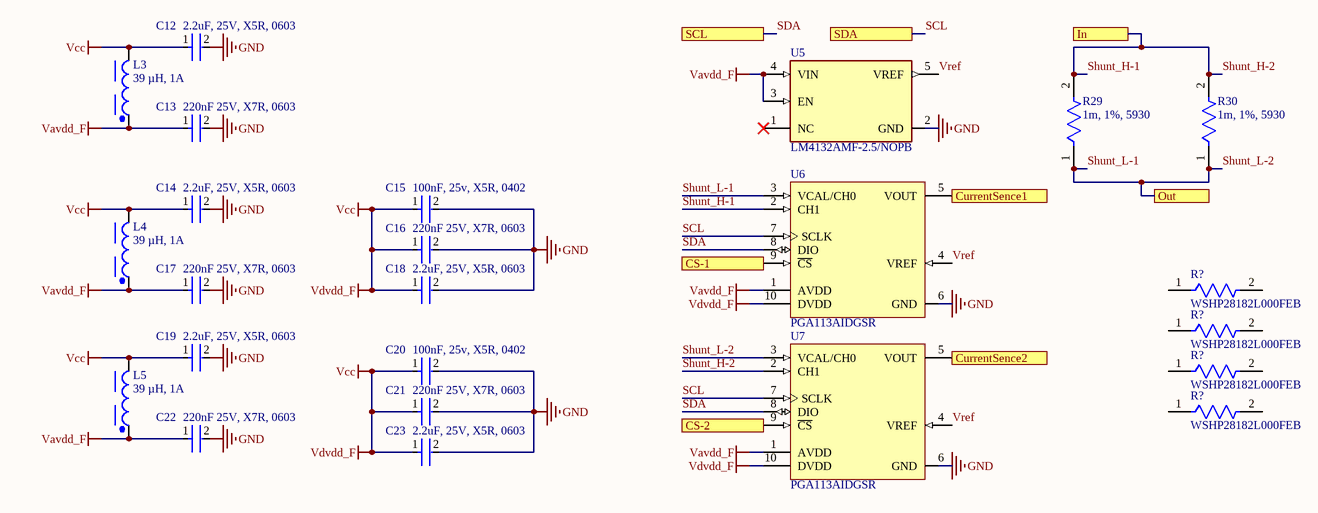
[diagram p3: MainShunt.SchDoc]

### Parts
(Parts that share a designator on the sheet are numbered #1, #2 ... from top to bottom, then left to right.)
C12  2.2uF, 25V, X5R, 0603  [FP-GRM188-0_1-e0_2_0_5-MFG]
C13  220nF 25V, X7R, 0603  [FP-GCM188-0_1-IPC_B]
C14  2.2uF, 25V, X5R, 0603  [FP-GRM188-0_1-e0_2_0_5-MFG]
C15  100nF, 25v, X5R, 0402  [FP-GRM155-0_05-IPC_C]
C16  220nF 25V, X7R, 0603  [FP-GCM188-0_1-IPC_B]
C17  220nF 25V, X7R, 0603  [FP-GCM188-0_1-IPC_B]
C18  2.2uF, 25V, X5R, 0603  [FP-GRM188-0_1-e0_2_0_5-MFG]
C19  2.2uF, 25V, X5R, 0603  [FP-GRM188-0_1-e0_2_0_5-MFG]
C20  100nF, 25v, X5R, 0402  [FP-GRM155-0_05-IPC_C]
C21  220nF 25V, X7R, 0603  [FP-GCM188-0_1-IPC_B]
C22  220nF 25V, X7R, 0603  [FP-GCM188-0_1-IPC_B]
C23  2.2uF, 25V, X5R, 0603  [FP-GRM188-0_1-e0_2_0_5-MFG]
L3  39 µH, 1A  [WE-PD_7345]
L4  39 µH, 1A  [WE-PD_7345]
L5  39 µH, 1A  [WE-PD_7345]
R29  1m, 1%, 5930  [FP-CSS2H-5930K-1L00F-MFG]
R30  1m, 1%, 5930  [FP-CSS2H-5930K-1L00F-MFG]
R?#11  WSHP28182L000FEB  [FP-WSHP2818-MFG]
R?#12  WSHP28182L000FEB  [FP-WSHP2818-MFG]
R?#13  WSHP28182L000FEB  [FP-WSHP2818-MFG]
R?#14  WSHP28182L000FEB  [FP-WSHP2818-MFG]
U5  LM4132AMF-2.5/NOPB  [FP-DBV0005A-IPC_C]
U6  PGA113AIDGSR  [DGS0010A_L]
U7  PGA113AIDGSR  [DGS0010A_L]

### Ports
CS-1 (see MainBoard[2A]), CS-2 (see MainBoard[2A]), CurrentSence1 (see MainBoard[3A]), CurrentSence2 (see MainBoard[3A]), In (see MainBoard[3A]), Out (see MainBoard[3A]), SCL (see MainBoard[2A]), SDA (see MainBoard[2A])

### Nets
GND: C12.2 C13.2 C14.2 C15.2 C16.2 C17.2 C18.2 C19.2 C20.2 C21.2 C22.2 C23.2 U5.2(GND) U6.6(GND) U7.6(GND)
Vavdd_F: C13.1 C17.1 C22.1 L3.1 L4.1 L5.1 U5.3(EN) U5.4(VIN) U6.1(AVDD) U7.1(AVDD)
Vcc: C12.1 C14.1 C15.1 C16.1 C18.1 C19.1 C20.1 C21.1 C23.1 L3.2 L4.2 L5.2 U6.10(DVDD) U7.10(DVDD)  [also labelled Vdvdd_F]
SCL: U6.7(SCLK) U7.7(SCLK) ; port SDA
SDA: U6.8(DIO) U7.8(DIO) ; port SCL
Shunt_H-1: R29.2 R30.2 U6.2(CH1) U7.2(CH1) ; port In  [also labelled Shunt_H-2]
Shunt_L-1: R29.1 R30.1 U6.3(VCAL/CH0) U7.3(VCAL/CH0) ; port Out  [also labelled Shunt_L-2]
Vref: U5.5(VREF) U6.4(VREF) U7.4(VREF)
NetU6_5: U6.5(VOUT) ; port CurrentSence1
NetU6_9: U6.9(~{CS}) ; port CS-1
NetU7_5: U7.5(VOUT) ; port CurrentSence2
NetU7_9: U7.9(~{CS}) ; port CS-2

Not connected (* = marked no-connect by the designer): R?#11 1 2; R?#12 1 2; R?#13 1 2; R?#14 1 2; U5 1(NC)*

### Library data of the parts
C12 C14 C18 C19 C23 = CMP-2006-02820-2: as C10 on sheet MainBoard; Number of Pins: 2; Dielectric: X5R; Tolerance: 10%; Case Code (Imperial): 0603; Thickness: 0.035inch; Case/Package: 0603; Lead Free: Lead Free; Mount: Surface Mount; Material: Ceramic; Depth: 0.8mm; Voltage: 25V; Capacitance: 2.2uF; Min Operating Temperature: -55°C; Package Quantity: 4000; REACH SVHC: No SVHC; Resistor Type: Ceramic; Packaging: Tape and Reel; Case Code (Metric): 1608; Max Operating Temperature: 85°C; Width: 0.8mm; Termination: SMD/SMT; Voltage Rating: 25V; Length: 1.6mm; Voltage Rating (DC): 25V; Height: 0.8mm; Radiation Hardening: No; Weight: 0.000222oz
C13 C16 C17 C21 C22 = CMP-2006-02366-2: as C11 on sheet MainBoard; Capacitance: 220nF; Mount: Surface Mount; Ratings: AEC-Q200; Case/Package: 0603; Packaging: Tape and Reel; Radiation Hardening: No; Voltage: 25V; Dielectric: X7R; Case Code (Imperial): 0603; Max Operating Temperature: 125°C; Min Operating Temperature: -55°C; Depth: 0.8mm; Termination: SMD/SMT; Package Quantity: 1; Case Code (Metric): 1608; Thickness: 0.035inch; Voltage Rating: 25V; Tolerance: 10%; Voltage Rating (DC): 25V; Height: 0.8mm; Lead Free: Lead Free; Length: 1.6mm; Width: 0.031inch
C15 C20 = CMP-06035-003661-1: as C28 on sheet MainBoard; Length: 1mm; Depth: 0.5mm; Dielectric: X7R; Voltage Rating: 25V; Lead Free: Lead Free; Case Code (Imperial): 0402; Voltage: 25V; Min Operating Temperature: -55°C; Tolerance: 10%; Dielectric Material: Ceramic; Voltage Rating (DC): 25V; Max Operating Temperature: 125°C; Capacitance: 100nF; Thickness: 0.022inch; Case/Package: 0402; Height: 0.5mm; Resistor Type: Ceramic; Weight: 0.000212oz; Case Code (Metric): 1005; Package Quantity: 10000; Termination: SMD/SMT; Width: 0.02inch; Mount: Surface Mount; Packaging: Tape and Reel
L3-L5 = CMP-0227-00153-2: as L2 on sheet MainBoard; Ambient Temperature Range Low: -40°C; Width: 7.3mm; Length: 7.3mm; Number of Pins: 2; Packaging: Tape & Reel; Height: 4.5mm; Ambient Temperature Range High: 85°C; Max Operating Temperature: 125°C; Depth: 7.3mm; Min Operating Temperature: -40°C; RoHS: Compliant; Current Rating: 1.11A
R29 R30 = CMP-00059-73869598-1: CSS2H-5930K-1L00F Res Metal Strip 5930 0.001 Ohm 1% 9W ±50ppm/C Pad SMD Automotive T/R; Resistance: 1mΩ; Temperature Coefficient: 50ppm/°C; Case Code (Imperial): 5931; Width: 7.747mm; Min Operating Temperature: -55°C; Tolerance: 1%; Max Power Dissipation: 9W; Case Code (Metric): 1577; Max Operating Temperature: 170°C; NexarPartId: 73869598; Power Rating: 9W; Composition: Metal Element; Case/Package: 5930; Height: 939.8µm; Number of Terminations: 2; Schedule B: 8533210045, 8533210045; Packaging: Cut Tape; REACH SVHC: No SVHC; Features: Moisture Resistant; RoHS: Compliant; Length: 15.0114mm
R?#11-R?#14 = CMP-00030-78727543-1: WSHP28182L000FEB Res Metal Strip 2818 0.002 Ohm 1% 10W ±200ppm/C Pad SMD Automotive T/R; Temperature Coefficient: 200ppm/°C; Resistance: 2mΩ; Case/Package: 2818; Packaging: Cut Tape; NexarPartId: 78727543; Composition: Metal Element; Height: 3.43mm; Power Rating: 10W; Min Operating Temperature: -65°C; Schedule B: 8533210045, 8533210045; Max Operating Temperature: 170°C; Tolerance: 1%; RoHS: Non-Compliant
U5 = CMP-0074-00531-5: IC VREF SERIES 0.05% SOT23-5; Quiescent Current: 100uA; Output Current: 20mA; Number of Channels: 1; Temperature Coefficient: 20ppm/°C; Max Input Voltage: 6V; Output Voltage: 2.5V; Max Supply Voltage: 2.2V; Dropout Voltage: 175mV; Supply Current: 60uA; Output Type: Fixed; Length: 2.92mm; Radiation Hardening: No; Reference Type: Series; Mount: Surface Mount; Packaging: Tape and Reel; Width: 1.6mm; Max Operating Temperature: 125°C; Lead Free: Lead Free; Series: -; Number of Pins: 5; REACH SVHC: No SVHC; Max Output Voltage: 2.5V; Package Quantity: 1000; Tolerance: 0.05%; Min Input Voltage: 2.2V; Case/Package: SOT-23; Termination: SMD/SMT; Height: 1.02mm; Min Output Voltage: 2.5V; Reference Voltage: 2.5V; Max Output Current: 20mA; Nominal Supply Current: 60uA; Min Operating Temperature: -40°C; Operating Supply Current: 100uA
U6 U7 = CMP-0988-00040-2: Zero-Drift, Programmable Gain Amplifier with MUX, -40 to 125 degC, 10-pin SOP (DGS10), Green (RoHS & no Sb/Br); Manufacturer: Texas Instruments; Vs(Max)(V): 5.5; Vs(Min)(V): 2.2; Slew Rate(Typ)(V/us): 3; Input Offset (+/-)(Max)(uV): 100; Common Mode Input High(Min)(V): AVdd -0.1V; Quiescent Current (+/-)(Typ)(mA): 1; Noise at 1kHz(Typ)(nV/rt(Hz)): 13; Gain Error (+/-)(Max)(%): 0.1; Number of Channels: 2; Input Bias Current (+/-)(Max)(nA): 5; Gain(V/V): 1, 2, 5, 10, 20, 50, 100, 200; Settling Time to 0.01%(Typ)(us): 2.55; Non-Linearity (+/-)(Max)(%): 0.0015; Common Mode Input Low(Min)(V): GND + 0.1V; Input Offset Drift (+/-)(Max)(uV/Degrees Celsius): 1.2; Code_JEDEC: MO-153; SubFamily: Programmable Gain Amplifier; ComponentLink2URL: http://www.ti.com/general/docs/lit/getliterature.tsp?genericPartNumber=PGA113&fileType=pdf; ComponentLink2Description: Datasheet; PackageReference: DGS0010A; ComponentLink3Description: Package Specification; ComponentLink1URL: http://www.ti.com/; PackageVersion: 4073272/C, 02/2004; ComponentLink3URL: http://www.ti.com/lit/ml/mpds035b/mpds035b.pdf; PackageDescription: 10-Pin Plastic Small Outline, Body 3 x 3 mm, Pitch 0.5 mm; Eco-Plan: Green (RoHS & no Sb/Br); ComponentLink1Description: Manufacturer URL; Mounting Technology: Surface Mount; PartNumber: PGA113AIDGSR; DatasheetVersion: SBOS424B